# Altium schematic sheet GSM IoT Block Diagram.SchDoc: GSM IoT Block Diagram
size 292 x 193 mm; DocumentNumber: 8; SheetNumber: 7; SheetTotal: 44
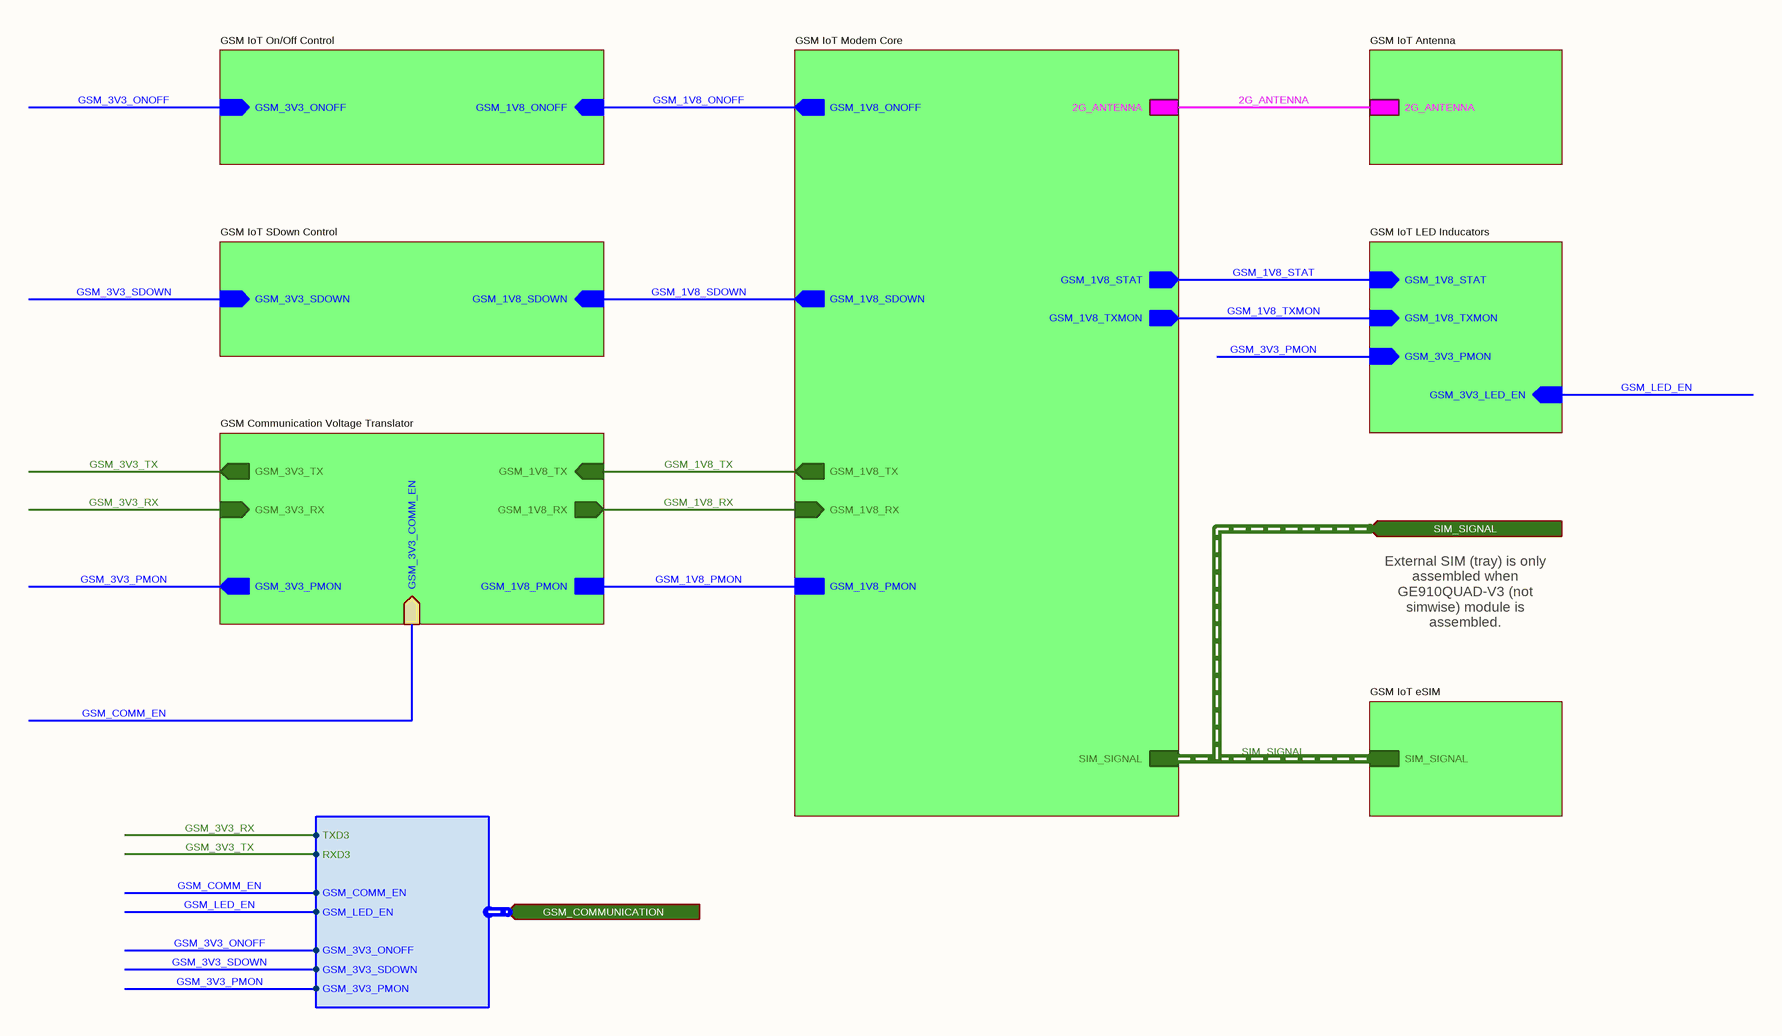
[diagram p0: GSM IoT Block Diagram.SchDoc]

## Sub-sheets
GSM Communication Voltage Translator = Bidirectional Voltage Translator.SchDoc: GSM_1V8_TX (in), GSM_1V8_RX (out), GSM_1V8_PMON, GSM_3V3_TX (out), GSM_3V3_RX (in), GSM_3V3_COMM_EN (in), GSM_3V3_PMON (out)
GSM IoT Antenna = GSM Modem Antenna.SchDoc: 2G_ANTENNA
GSM IoT eSIM = GSM eSIM.SchDoc: SIM_SIGNAL (harness SIM_SIGNAL)
GSM IoT LED Inducators = GSM LED Driver.SchDoc: GSM_1V8_STAT (in), GSM_3V3_PMON (in), GSM_3V3_LED_EN (in), GSM_1V8_TXMON (in)
GSM IoT Modem Core = GSM Modem Core.SchDoc: GSM_1V8_TXMON (out), SIM_SIGNAL (harness SIM_SIGNAL), 2G_ANTENNA, GSM_1V8_STAT (out), GSM_1V8_RX (in), GSM_1V8_ONOFF (out), GSM_1V8_SDOWN (out), GSM_1V8_TX (out), GSM_1V8_PMON
GSM IoT On/Off Control = GSM On-Off Control.SchDoc: GSM_3V3_ONOFF (in), GSM_1V8_ONOFF (in)
GSM IoT SDown Control = GSM SDown Control.SchDoc: GSM_3V3_SDOWN (in), GSM_1V8_SDOWN (in)

## Ports
GSM_COMMUNICATION (in, harness GSM_COMMUNICATION), SIM_SIGNAL (in, harness SIM_SIGNAL)

## Harnesses
GSM_COMMUNICATION: GSM_3V3_ONOFF, GSM_LED_EN, GSM_COMM_EN, GSM_3V3_SDOWN, GSM_3V3_PMON, RXD3, TXD3

## Nets
2G_ANTENNA: sheet GSM IoT Modem Core/2G_ANTENNA, sheet GSM IoT Antenna/2G_ANTENNA
GSM_1V8_ONOFF: sheet GSM IoT Modem Core/GSM_1V8_ONOFF, sheet GSM IoT On/Off Control/GSM_1V8_ONOFF
GSM_1V8_PMON: sheet GSM IoT Modem Core/GSM_1V8_PMON, sheet GSM Communication Voltage Translator/GSM_1V8_PMON
GSM_1V8_RX: sheet GSM IoT Modem Core/GSM_1V8_RX, sheet GSM Communication Voltage Translator/GSM_1V8_RX
GSM_1V8_SDOWN: sheet GSM IoT Modem Core/GSM_1V8_SDOWN, sheet GSM IoT SDown Control/GSM_1V8_SDOWN
GSM_1V8_STAT: sheet GSM IoT Modem Core/GSM_1V8_STAT, sheet GSM IoT LED Inducators/GSM_1V8_STAT
GSM_1V8_TX: sheet GSM IoT Modem Core/GSM_1V8_TX, sheet GSM Communication Voltage Translator/GSM_1V8_TX
GSM_1V8_TXMON: sheet GSM IoT Modem Core/GSM_1V8_TXMON, sheet GSM IoT LED Inducators/GSM_1V8_TXMON
GSM_3V3_ONOFF: sheet GSM IoT On/Off Control/GSM_3V3_ONOFF, port GSM_COMMUNICATION.GSM_3V3_ONOFF
GSM_3V3_PMON: sheet GSM Communication Voltage Translator/GSM_3V3_PMON, sheet GSM IoT LED Inducators/GSM_3V3_PMON, port GSM_COMMUNICATION.GSM_3V3_PMON
GSM_3V3_RX: sheet GSM Communication Voltage Translator/GSM_3V3_RX, port GSM_COMMUNICATION.TXD3
GSM_3V3_SDOWN: sheet GSM IoT SDown Control/GSM_3V3_SDOWN, port GSM_COMMUNICATION.GSM_3V3_SDOWN
GSM_3V3_TX: sheet GSM Communication Voltage Translator/GSM_3V3_TX, port GSM_COMMUNICATION.RXD3
GSM_COMM_EN: sheet GSM Communication Voltage Translator/GSM_3V3_COMM_EN, port GSM_COMMUNICATION.GSM_COMM_EN
GSM_LED_EN: sheet GSM IoT LED Inducators/GSM_3V3_LED_EN, port GSM_COMMUNICATION.GSM_LED_EN

## Buses and harness runs
harness SIM_SIGNAL = port SIM_SIGNAL = sheet GSM IoT eSIM/SIM_SIGNAL = sheet GSM IoT Modem Core/SIM_SIGNAL

## Notes on the sheet
- External SIM (tray) is only assembled when GE910QUAD-V3 (not simwise) module is assembled.
- © 2021 All rights reserved.
  This document may not, in whole or in part, be copied, photocopied, reproduced, translated or converted to any electronic or machine readable from without prior written permission of Mehmet Günce Akkoyun.
  Engineer contact : akkoyun@me.com
- Property of
- Engineer :
- Date :
- Size :
- A4
- Time :
- Project :
- Page :
- /
- Customer :
- Product ID :
- Module ID :
- Version :
- File :
- Revision :